# Altium project Elekid_Breakout_Board.PrjPcb
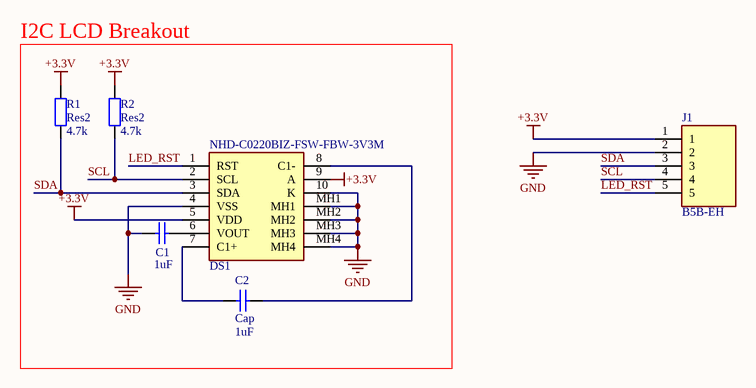
[diagram p0: Breakout_Board.SchDoc]
1 sheet, 6 parts. Net scope: global (net labels, ports and power ports of the same name join across sheets).
Board file: Breakout_Board.PcbDoc

## Sheet Breakout_Board.SchDoc
size A4

### Parts
C1  value 1uF  [C0805]  (hidden comment: Cap)
C2  Cap  value 1uF  [C0805]
DS1  NHD-C0220BIZ-FSW-FBW-3V3M  [NHDC0220BIZFSWFBW3V3M]
J1  B5B-EH  [SHDR5W64P0X250_1X5_1500X380X600P]
R1  Res2  value 4.7k  [C0805]
R2  Res2  value 4.7k  [C0805]

### Blocks framed on the sheet
I2C LCD Breakout: C1 C2 DS1 R1 R2

### Nets
+3.3V: DS1.5(VDD) DS1.9(A) J1.1 R1.2 R2.2
GND: C1.1 DS1.4(VSS) DS1.10(K) DS1.MH1 DS1.MH2 DS1.MH3 DS1.MH4 J1.2
LED_RST: DS1.1(RST) J1.5
SCL: DS1.2(SCL) J1.4 R2.1
SDA: DS1.3(SDA) J1.3 R1.1
NetC1_2: C1.2 DS1.6(VOUT)
NetC2_1: C2.1 DS1.7(C1+)
NetC2_2: C2.2 DS1.8(C1-)

### Library data of the parts
C1 C2 = Cap: Capacitor; Published: 8-Jun-2000; LatestRevisionDate: 17-Jul-2002; LatestRevisionNote: Re-released for DXP Platform.; PackageReference: RAD-0.3; Publisher: Altium Limited; PackageDescription: Radial Cap, Thru-Hole; 2 Leads; 0.3 in Pin Spacing
DS1 = NHD-C0220BIZ-FSW-FBW-3V3M: Display; Manufacturer_Name: Newhaven Display; Datasheet Link: https://componentsearchengine.com/Datasheets/1/NHD-C0220BiZ-FSW-FBW-3V3M.pdf; Height: 7mm; Manufacturer_Part_Number: NHD-C0220BIZ-FSW-FBW-3V3M; Arrow Part Number: NHD-C0220BIZ-FSW-FBW-3V3M; Mouser Part Number: 763-C0220BIZ-FSW-FBW; Mouser Price/Stock: https://www.mouser.com/Search/Refine.aspx?Keyword=763-C0220BIZ-FSW-FBW
J1 = B5B-EH: Connector; Manufacturer_Name: JST (JAPAN SOLDERLESS TERMINALS); Datasheet Link: http://www.jst-mfg.com/product/pdf/eng/eEH.pdf; Height: 6mm; Manufacturer_Part_Number: B5B-EH
R1 R2 = Res2: Resistor; Published: 8-Jun-2000; LatestRevisionDate: 17-Jul-2002; LatestRevisionNote: Re-released for DXP Platform.; PackageReference: AXIAL-0.4; Publisher: Altium Limited; PackageDescription: Axial Device, Thru-Hole; 2 Leads; 0.4 in Pin Spacing